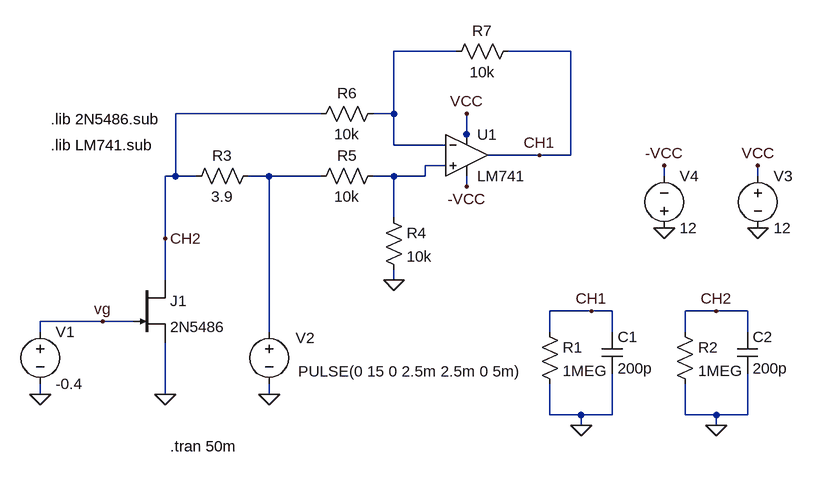
[diagram p0: schematic Medicion_JFETN_ConAmplificacion.asc]
Medicion_JFETN_ConAmplificacion.asc, the LTspice schematic file:
Version 4
SHEET 1 2680 1460
WIRE 1168 512 1072 512
WIRE 1344 512 1248 512
WIRE 960 608 736 608
WIRE 1072 608 1072 512
WIRE 1072 608 1040 608
WIRE 1184 640 1184 608
WIRE 1072 656 1072 608
WIRE 1152 656 1072 656
WIRE 1184 656 1184 640
WIRE 1296 672 1216 672
WIRE 1344 672 1344 512
WIRE 1344 672 1296 672
WIRE 1152 688 1120 688
WIRE 736 704 736 608
WIRE 736 704 720 704
WIRE 768 704 736 704
WIRE 880 704 848 704
WIRE 960 704 880 704
WIRE 1072 704 1040 704
WIRE 1120 704 1120 688
WIRE 1120 704 1072 704
WIRE 1488 704 1488 688
WIRE 1632 704 1632 688
WIRE 1184 720 1184 704
WIRE 1072 768 1072 704
WIRE 720 800 720 704
WIRE 720 864 720 800
WIRE 1072 864 1072 848
WIRE 1376 912 1312 912
WIRE 1408 912 1376 912
WIRE 1568 912 1520 912
WIRE 1616 912 1568 912
WIRE 624 928 528 928
WIRE 672 928 624 928
WIRE 528 944 528 928
WIRE 880 944 880 704
WIRE 1312 944 1312 912
WIRE 1408 944 1408 912
WIRE 1520 944 1520 912
WIRE 1616 944 1616 912
WIRE 528 1040 528 1024
WIRE 720 1040 720 960
WIRE 880 1040 880 1024
WIRE 1312 1072 1312 1024
WIRE 1360 1072 1312 1072
WIRE 1408 1072 1408 1008
WIRE 1408 1072 1360 1072
WIRE 1520 1072 1520 1024
WIRE 1568 1072 1520 1072
WIRE 1616 1072 1616 1008
WIRE 1616 1072 1568 1072
WIRE 1360 1088 1360 1072
WIRE 1568 1088 1568 1072
FLAG 720 1040 0
FLAG 624 928 vg
FLAG 528 1040 0
FLAG 880 1040 0
FLAG 1360 1088 0
FLAG 1568 1088 0
FLAG 1376 912 CH1
FLAG 1568 912 CH2
FLAG 1072 864 0
FLAG 1632 784 0
FLAG 720 800 CH2
FLAG 1296 672 CH1
FLAG 1488 784 0
FLAG 1184 608 VCC
FLAG 1184 720 -VCC
FLAG 1488 688 -VCC
FLAG 1632 688 VCC
SYMBOL voltage 880 928 R0
WINDOW 0 41 25 Left 2
WINDOW 3 45 77 Left 2
WINDOW 123 0 0 Left 2
WINDOW 39 0 0 Left 2
SYMATTR InstName V2
SYMATTR Value PULSE(0 15 0 2.5m 2.5m 0 5m)
SYMBOL njf 672 864 R0
SYMATTR InstName J1
SYMATTR Value 2N5486
SYMBOL res 1296 928 R0
SYMATTR InstName R1
SYMATTR Value 1MEG
SYMBOL cap 1392 944 R0
SYMATTR InstName C1
SYMATTR Value 200p
SYMBOL res 1504 928 R0
SYMATTR InstName R2
SYMATTR Value 1MEG
SYMBOL cap 1600 944 R0
SYMATTR InstName C2
SYMATTR Value 200p
SYMBOL res 864 688 R90
WINDOW 0 0 56 VBottom 2
WINDOW 3 32 56 VTop 2
SYMATTR InstName R3
SYMATTR Value 3.9
SYMBOL Opamps\\opamp2 1184 608 R0
SYMATTR InstName U1
SYMATTR Value LM741
SYMBOL res 1056 752 R0
SYMATTR InstName R4
SYMATTR Value 10k
SYMBOL res 1056 688 R90
WINDOW 0 0 56 VBottom 2
WINDOW 3 32 56 VTop 2
SYMATTR InstName R5
SYMATTR Value 10k
SYMBOL res 1056 592 R90
WINDOW 0 0 56 VBottom 2
WINDOW 3 32 56 VTop 2
SYMATTR InstName R6
SYMATTR Value 10k
SYMBOL res 1264 496 R90
WINDOW 0 0 56 VBottom 2
WINDOW 3 32 56 VTop 2
SYMATTR InstName R7
SYMATTR Value 10k
SYMBOL voltage 1632 688 R0
SYMATTR InstName V3
SYMATTR Value 12
SYMBOL voltage 1488 800 M180
WINDOW 0 24 96 Left 2
WINDOW 3 24 16 Left 2
SYMATTR InstName V4
SYMATTR Value 12
SYMBOL voltage 528 928 R0
SYMATTR InstName V1
SYMATTR Value -0.4
TEXT 544 616 Left 2 !.lib 2N5486.sub
TEXT 728 1120 Left 2 !.tran 50m
TEXT 544 656 Left 2 !.lib LM741.sub

The netlist it stands for:
* Medicion_JFETN_ConAmplificacion.asc
V2 N003 0 PULSE(0 15 0 2.5m 2.5m 0 5m)
J1 CH2 vg 0 2N5486
R1 CH1 0 1MEG
C1 CH1 0 200p
R2 CH2 0 1MEG
C2 CH2 0 200p
R3 N003 CH2 3.9
XU1 N002 N001 VCC -VCC CH1 LM741  ; pins In+ In- V+ V- OUT
R4 N002 0 10k
R5 N002 N003 10k
R6 N001 CH2 10k
R7 CH1 N001 10k
V3 VCC 0 12
V4 0 -VCC 12
V1 vg 0 -0.4
.model NJF NJF
.model PJF PJF
.lib standard.jft
.lib 2N5486.sub
.tran 50m
.lib LM741.sub
.backanno
.end